# EAGLE design digit (EAGLE 4.16)
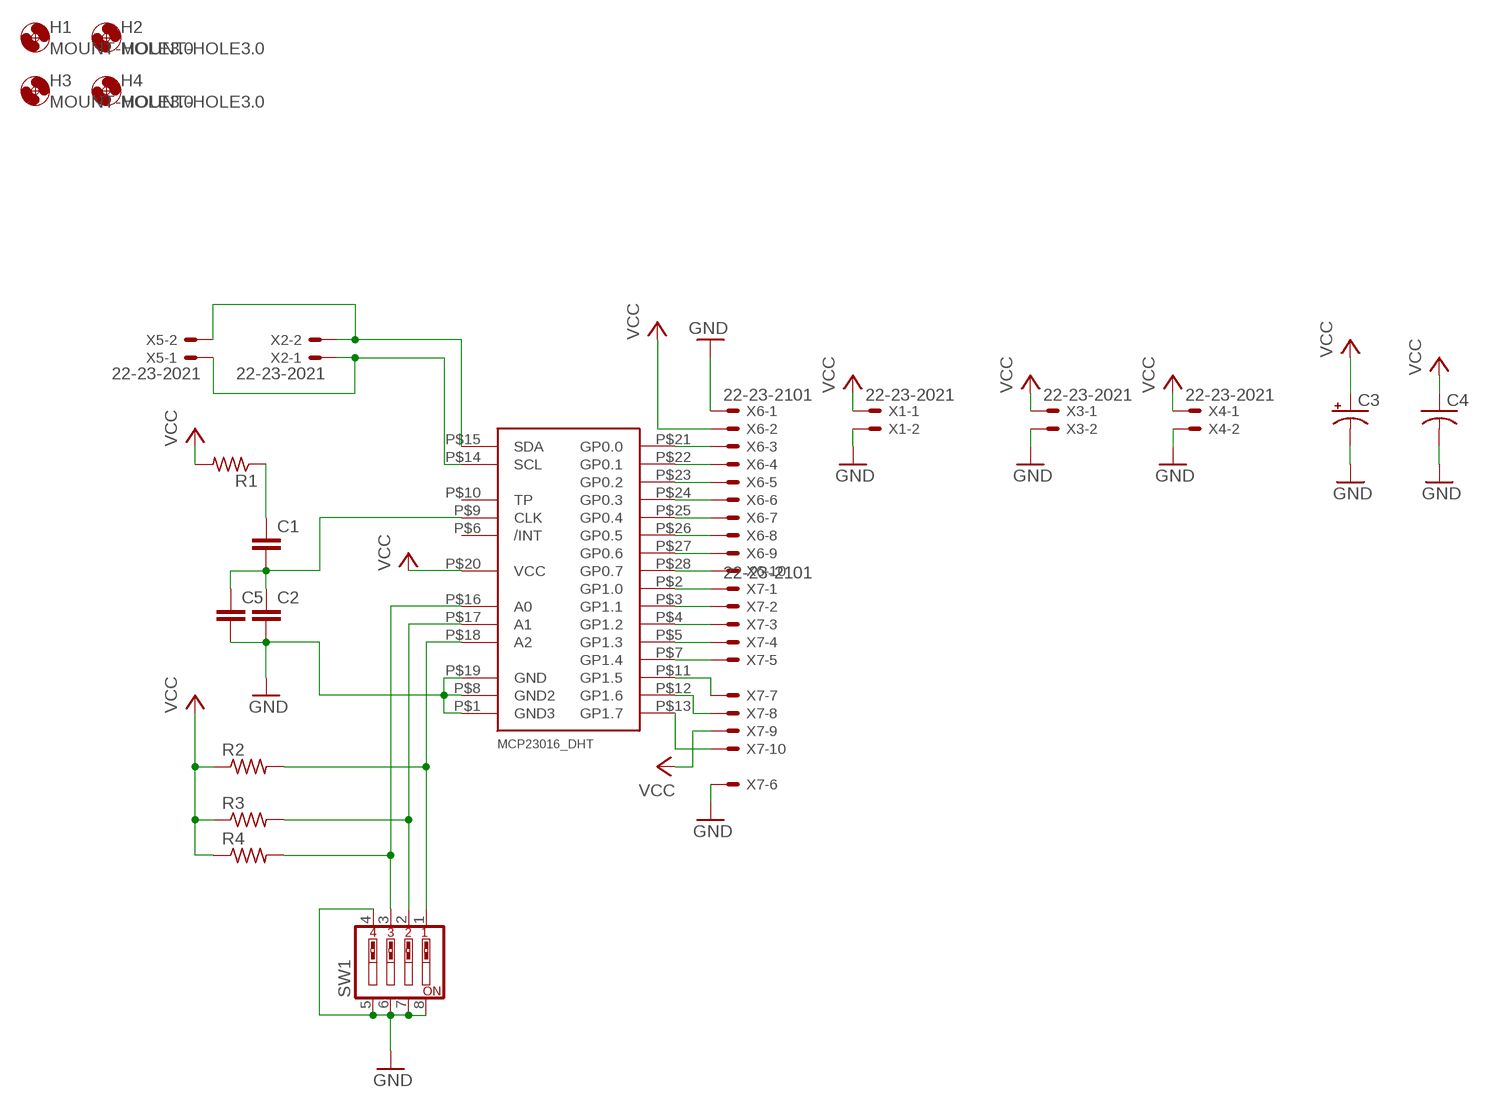
[diagram p0: schematic, sheet 1]

## Parts
C1  C2,5-3  [C2.5-3]
C2  C2,5-3  [C2.5-3]
C3  CPOL-USE5-8.5  [E5-8,5]
C4  C-US050-025X075  [C050-025X075]
C5  C2,5-3  [C2.5-3]
H1  MOUNT-HOLE3.0  [3,0]
H2  MOUNT-HOLE3.0  [3,0]
H3  MOUNT-HOLE3.0  [3,0]
H4  MOUNT-HOLE3.0  [3,0]
R1  R-US_0207/10  [0207/10]
R2  R-US_0207/10  [0207/10]
R3  R-US_0207/10  [0207/10]
R4  R-US_0207/10  [0207/10]
SW1  SW_DIP-4  [EDG-04]
U$1  MCP23016_DHT  [MCP23016_DHT]
X1  22-23-2021  [22-23-2021]
X2  22-23-2021  [22-23-2021]
X3  22-23-2021  [22-23-2021]
X4  22-23-2021  [22-23-2021]
X5  22-23-2021  [22-23-2021]
X6  22-23-2101  [22-23-2101]
X7  22-23-2101  [22-23-2101]

## Nets
GND: C2.2 C3.- C4.2 C5.2 SW1.4 SW1.5 SW1.6 SW1.7 SW1.8 U$1.P$1(GND3) U$1.P$8(GND2) U$1.P$19(GND) X1.2 X3.2 X4.2 X6.1 X7.6
N$1: U$1.P$15(SDA) X2.2 X5.2
N$2: U$1.P$21(GP0.0) X6.3
N$3: U$1.P$14(SCL) X2.1 X5.1
N$4: U$1.P$11(GP1.5) X7.7
N$5: U$1.P$22(GP0.1) X6.4
N$6: U$1.P$23(GP0.2) X6.5
N$7: U$1.P$24(GP0.3) X6.6
N$8: U$1.P$25(GP0.4) X6.7
N$9: U$1.P$26(GP0.5) X6.8
N$10: U$1.P$27(GP0.6) X6.9
N$11: U$1.P$28(GP0.7) X6.10
N$12: U$1.P$2(GP1.0) X7.1
N$13: U$1.P$3(GP1.1) X7.2
N$14: U$1.P$4(GP1.2) X7.3
N$15: U$1.P$5(GP1.3) X7.4
N$16: U$1.P$7(GP1.4) X7.5
N$17: U$1.P$12(GP1.6) X7.8
N$18: U$1.P$13(GP1.7) X7.10
N$20: C1.2 C2.1 C5.1 U$1.P$9(CLK)
N$22: R2.2 SW1.1 U$1.P$18(A2)
N$23: C1.1 R1.1
N$24: R3.2 SW1.2 U$1.P$17(A1)
N$25: R4.2 SW1.3 U$1.P$16(A0)
VCC: C3.+ C4.1 R1.2 R2.1 R3.1 R4.1 U$1.P$20(VCC) X1.1 X3.1 X4.1 X6.2 X7.9
Unconnected: U$1.P$6(/INT) U$1.P$10(TP)

## Library data of the parts
C1 C2 C5 = capacitor-wima:C: CAPACITOR naming: grid - package width
C3 = rcl:CPOL-US: POLARIZED CAPACITOR, American symbol
C4 = rcl:C-US: CAPACITOR, American symbol
H1-H4 = holes:MOUNT-HOLE: MOUNTING HOLE with drill center marker
R1-R4 = rcl:R-US_: RESISTOR, American symbol
SW1 = special:SW_DIP-4: DIP SWITCH
U$1 = aggiunte:MCP23016_DHT: MCP23016 I2C expander a 16 bit
X1-X5 = con-molex:22-23-2021: .100" (2.54mm) Center Header - 2 Pin
X6 X7 = con-molex:22-23-2101: .100" (2.54mm) Center Header - 10 Pin

## Board
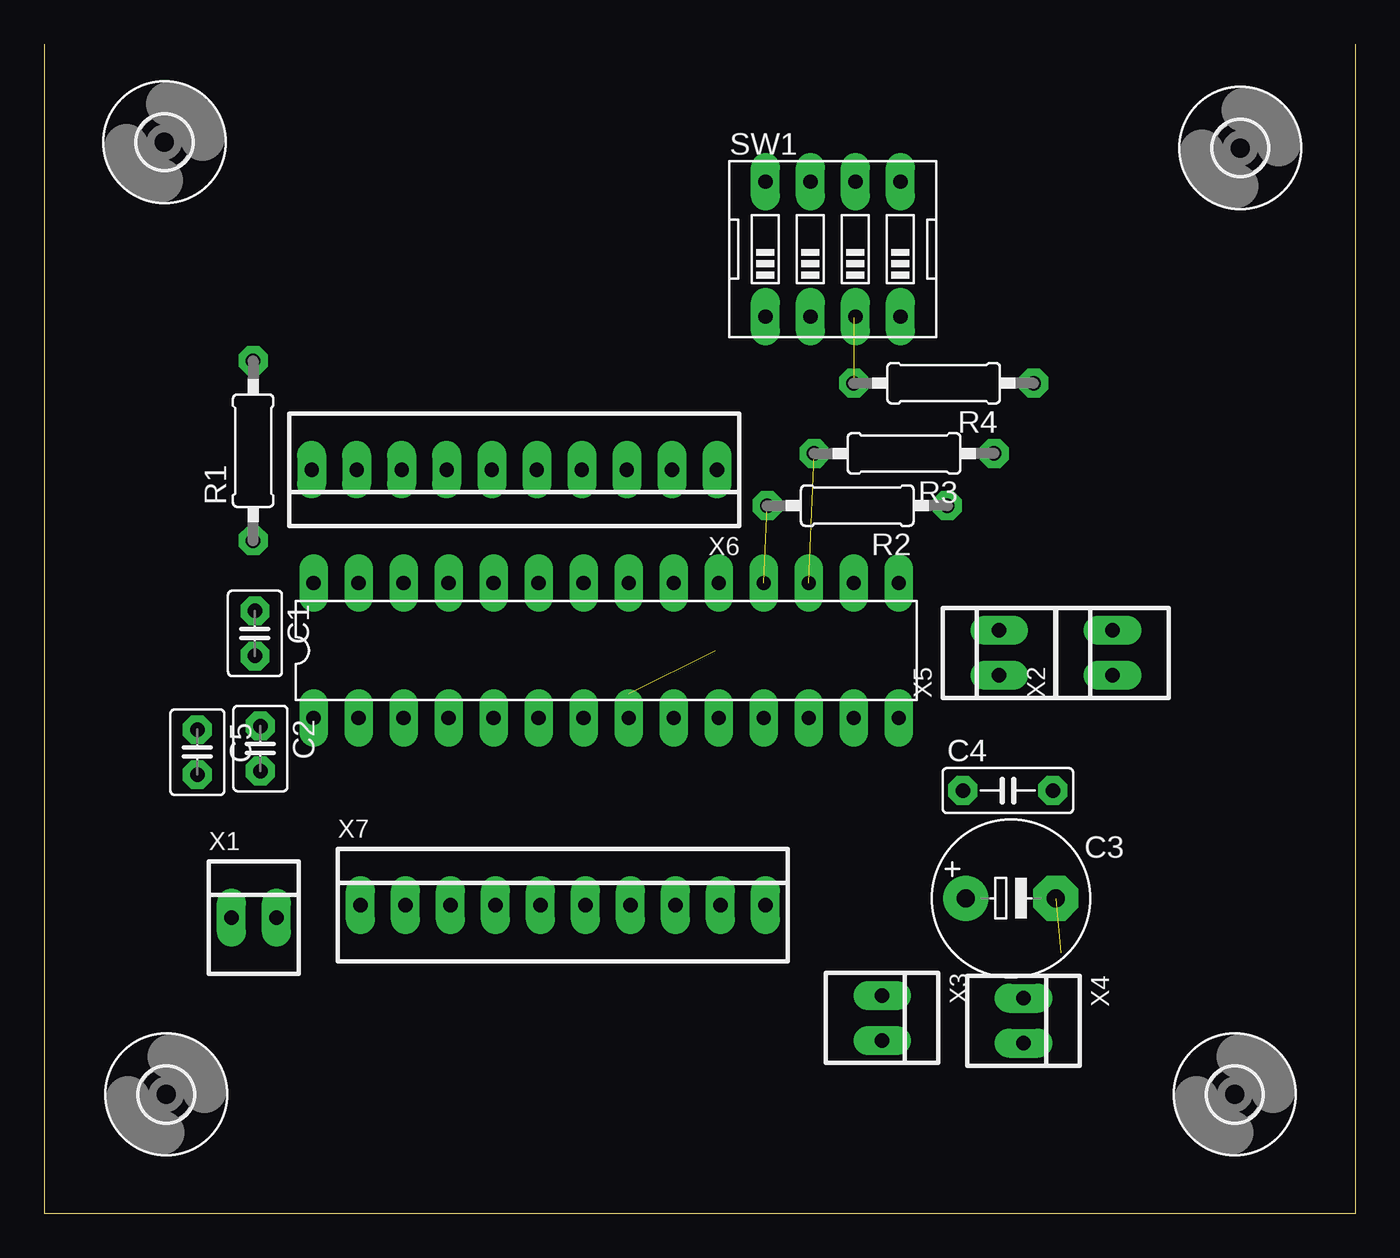
[diagram p1: board, top side]
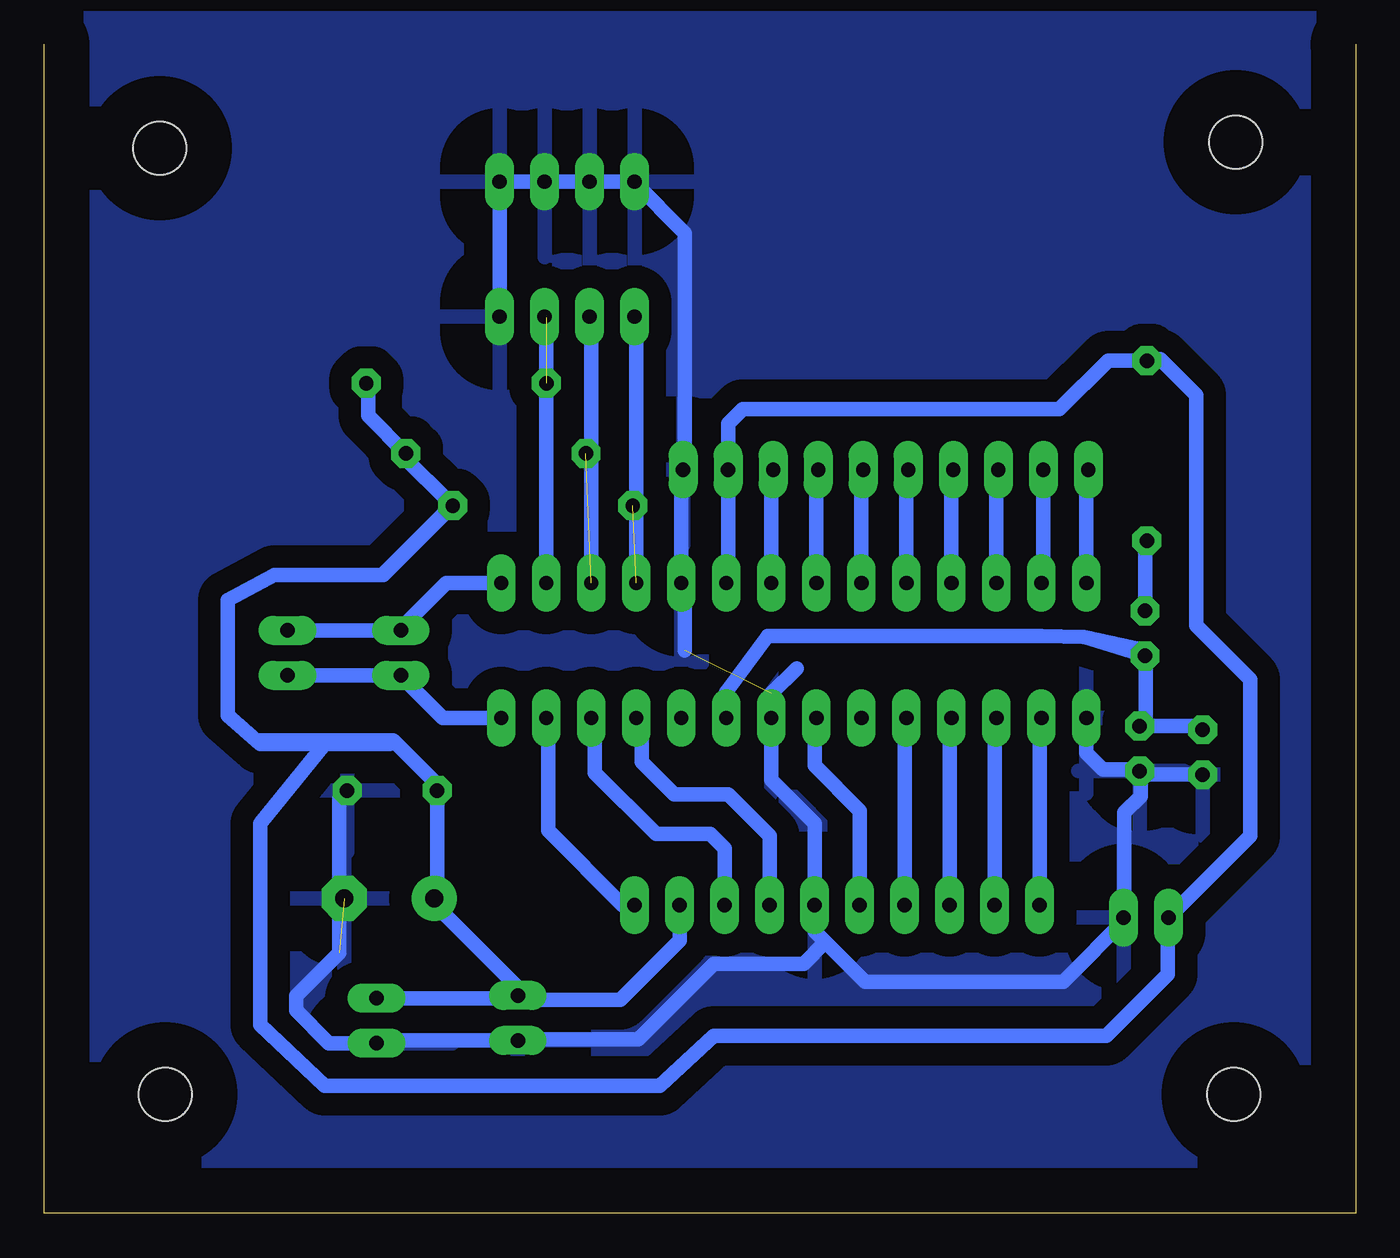
[diagram p2: board, bottom side, seen from below]

Size 74 x 66 mm. Coordinates in mm from the lower left corner, seen from the top.
Outline: 74,66 74,0 0,0 0,66
Copper layers (1*16): Top 0.035mm / dielectric 1.5mm / Bottom 0.035mm
Design rules "mio2": minimum track width 24mil, minimum drill 24mil, track to track 50mil, track to pad 50mil, pad to pad 50mil, via to via 50mil, smd to smd 50mil, copper to edge 100mil, drill to drill 100mil, minimum pad ring 16mil, minimum via ring 16mil, stop-mask expansion 4mil, vias tented up to drill 0mil, thermal gap 100mil

### Footprints (pad centres in the part's own frame; a part is rotated, then mirrored left to right if it is on the bottom)
C2.5-3 = drill 0.813 pad 1.6 octagon: 1 -1.27,0; 2 1.27,0
E5-8,5 = drill 1.016 pad 2.54 round: + -2.54,0 | drill 1.016 pad 2.54 octagon: - 2.54,0
C050-025X075 = drill 0.813 octagon: 1 -2.54,0; 2 2.54,0
3,0 = hole 3: 0,0
0207/10 = drill 0.813 octagon: 1 -5.08,0; 2 5.08,0
EDG-04 = drill 0.813 long: 1 -3.81,-3.81; 2 -1.27,-3.81; 3 1.27,-3.81; 4 3.81,-3.81; 5 3.81,3.81; 6 1.27,3.81; 7 -1.27,3.81; 8 -3.81,3.81
MCP23016_DHT = drill 0.8 long: P$1 0,0; P$2 2.54,0; P$3 5.08,0; P$4 7.62,0; P$5 10.16,0; P$6 12.7,0; P$7 15.24,0; P$8 17.78,0; P$9 20.32,0; P$10 22.86,0; P$11 25.4,0; P$12 27.94,0; P$13 30.48,0; P$14 33.02,0; P$15 33.02,7.62; P$16 30.48,7.62; P$17 27.94,7.62; P$18 25.4,7.62; P$19 22.86,7.62; P$20 20.32,7.62; P$21 17.78,7.62; P$22 15.24,7.62; P$23 12.7,7.62; P$24 10.16,7.62; P$25 7.62,7.62; P$26 5.08,7.62; P$27 2.54,7.62; P$28 0,7.62
22-23-2021 = drill 0.813 long: 1 -1.27,0; 2 1.27,0
22-23-2101 = drill 0.813 long: 1 -11.43,0; 2 -8.89,0; 3 -6.35,0; 4 -3.81,0; 5 -1.27,0; 6 1.27,0; 7 3.81,0; 8 6.35,0; 9 8.89,0; 10 11.43,0

### Placement (x,y rotation side)
C1  11.89,32.74 270 top
C2  12.19,26.24 270 top
C3  54.54,17.79 0 top
C4  54.37,23.87 0 top
C5  8.64,26.04 270 top
H1  6.88,6.72 0 top
H2  67.48,60.14 0 top
H3  6.78,60.47 0 top
H4  67.18,6.72 0 top
R1  11.79,43.06 90 top
R2  45.87,39.96 180 top
R3  48.52,42.9 180 top
R4  50.75,46.87 180 top
SW1  44.5,54.44 0 top
U$1  15.19,27.97 0 top
X1  11.82,16.7 0 top
X2  60.28,31.64 90 top
X3  47.28,11.04 270 top
X4  55.26,10.88 270 top
X5  53.88,31.64 90 top
X6  26.52,41.99 180 top
X7  29.26,17.4 0 top

### Tracks (layer width: path | path; a pad name or v marks a point on that pad's centre or on a via)
GND  (2 unrouted)
  Bottom 0.813: 12.14,24.77 C5.2 | 12.14,24.77 12.24,24.87 | U$1.P$1 15.19,25.99 14.28,25.07 12.45,25.07 12.24,24.87 | 12.24,24.87 12.19,24.92 C2.2 | 12.14,24.77 12.14,23.55 13.06,22.63 13.06,16.54 13.09,16.57 X1.2 12.89,16.7 | SW1.4 48.31,58.09 48.41,58.2 48.36,58.25 SW1.5 46.03,58.25 45.98,58.2 45.93,58.25 SW1.6 40.74,58.25 | SW1.8 40.69,58.2 40.74,58.25 | 37.85,41.89 37.85,41.53 | 37.85,41.89 X6.1 37.95,42.24 38.05,42.34 U$1.P$19 37.85,35.39 37.85,31.78 | 40.74,58.25 37.85,55.35 37.85,41.89 | 29.92,15.32 27.69,13.08 16.51,13.08 12.89,16.7 | 29.92,15.32 30.53,15.93 X7.6 30.53,22.02 32.97,24.46 U$1.P$8 32.97,29.34 31.55,30.76 | 12.89,16.7 12.85,16.74 | 29.92,15.32 31.14,14.1 36.22,14.1 40.49,9.83 46.79,9.83 46.99,9.63 47.13,9.77 X3.2 54.98,9.77 55.14,9.61 X4.2 57.95,9.61 59.79,11.46 59.79,12.27 57.36,14.71 57.36,23.45 56.93,23.87 C4.2
  pour Bottom: 0.63,0.47 0.63,67.47 72.63,67.47 72.63,1.47 0.63,1.47
N$1
  Bottom 0.813: U$1.P$15 51.31,35.59 53.9,33 53.88,32.98 X5.2 60.49,32.91 | 60.49,32.91 X2.2 | 60.49,32.91 60.61,32.8
N$2
  Bottom 0.813: 32.87,42.04 32.77,42.14 | 32.87,42.04 X6.3 | U$1.P$21 32.97,41.94 32.87,42.04
N$3
  Bottom 0.813: U$1.P$14 51.51,27.97 53.88,30.34 X5.1 60.18,30.37 60.2,30.36 60.22,30.37 X2.1
N$4
  Bottom 0.813: X7.7 33.07,21.31 35.41,23.65 38.46,23.65 40.29,25.48 40.29,27.51 40.69,27.92 40.64,27.97 U$1.P$11
N$5
  Bottom 0.813: X6.4 30.33,41.94 30.43,41.84 U$1.P$22
N$6
  Bottom 0.813: X6.5 27.79,41.84 27.69,41.74 27.89,41.53 U$1.P$23
N$7
  Bottom 0.813: X6.6 25.1,41.99 25.05,41.94 25.35,41.63 U$1.P$24
N$8
  Bottom 0.813: 22.56,41.99 22.4,42.14 | 22.56,41.99 X6.7 | U$1.P$25 22.81,41.74 22.56,41.99
N$9
  Bottom 0.813: X6.8 20.17,41.74 20.27,41.63 U$1.P$26
N$10
  Bottom 0.813: 17.63,35.54 17.68,35.59 U$1.P$27 | 17.63,35.54 X6.9 | 17.63,35.54 17.53,35.44
N$11
  Bottom 0.813: X6.10 15.09,42.14 15.19,42.04 U$1.P$28
N$12
  Bottom 0.813: 17.83,28.02 17.78,27.97 U$1.P$2 | X7.1 17.83,28.02 | 17.83,28.02 17.93,28.12
N$13
  Bottom 0.813: U$1.P$3 20.32,27.97 20.37,27.92 X7.2
N$14
  Bottom 0.813: U$1.P$4 22.81,28.12 22.91,28.02 X7.3
N$15
  Bottom 0.813: 25.35,28.02 25.25,28.12 | 25.35,28.02 U$1.P$5 | X7.4 25.45,27.92 25.35,28.02
N$16
  Bottom 0.813: X7.5 27.99,22.74 30.53,25.28 30.53,28.12 30.43,28.02 U$1.P$7
N$17
  Bottom 0.813: X7.8 35.61,20.6 36.43,21.42 39.47,21.42 42.93,24.87 42.93,27.51 43.13,27.71 U$1.P$12
N$18
  Bottom 0.813: X7.10 41.35,17.4 45.57,21.62 45.57,27.92 45.62,27.97 U$1.P$13
N$20
  Bottom 0.813: 11.84,31.47 11.84,31.58 | 11.84,31.47 C1.2 15.34,32.54 | 11.84,31.47 11.84,27.51 C2.1 8.59,27.51 8.59,27.31 C5.1 | U$1.P$9 35.51,29.44 33.17,32.59 17.73,32.59 15.34,32.54 | 15.34,32.54 11.84,31.78
N$22  (1 unrouted)
  Bottom 0.813: 40.69,50.68 40.9,50.88 | 40.69,50.68 SW1.1 | U$1.P$18 40.59,50.57 40.69,50.68
N$23
  Bottom 0.813: 11.74,37.98 11.64,38.08 | 11.74,37.98 R1.1 | C1.1 11.89,37.82 11.74,37.98
N$24  (1 unrouted)
  Bottom 0.813: SW1.2 43.23,50.57 43.33,50.47 43.13,50.27 U$1.P$17
N$25  (1 unrouted)
  Bottom 0.813: 45.62,50.63 45.57,50.68 | 45.62,50.63 SW1.3 | U$1.P$16 45.67,50.57 45.62,50.63
VCC
  Bottom 0.813: X7.9 38.15,15.42 41.51,12.07 46.79,12.07 47.2,12.48 47.28,12.39 X3.1 | 55.73,46.97 55.73,47.02 | 55.73,46.97 R4.1 | 55.73,46.97 55.73,45.04 R3.1 53.65,42.95 53.9,42.95 53.9,42.9 R2.1 | U$1.P$20 35.41,35.69 X6.2 35.41,44.58 34.6,45.39 16.71,45.39 13.97,48.14 R1.2 11.74,48.14 11.64,48.24 11.02,48.24 8.99,46.21 8.99,33.2 5.95,30.15 5.95,21.31 X1.1 10.59,16.74 10.62,16.74 10.62,13.49 14.07,10.04 36.22,10.04 39.27,7.19 58.17,7.19 61.83,10.65 61.83,22.02 58.17,26.5 | 50.9,39.91 R2.1 | 50.9,39.91 50.85,39.91 | R2.1 54.87,36.05 54.92,36.05 | 63.65,28.12 62.03,26.7 | X3.1 47.16,12.31 46.99,12.48 52.01,17.49 C3.+ 51.9,17.79 51.87,17.76 51.83,17.79 C4.1 51.83,24.23 54.31,26.7 62.03,26.7 | 61.83,26.5 63.65,28.12 | X3.1 47.28,12.36 47.4,12.48 47.72,12.15 X4.1 | 50.9,39.91 51.06,39.91 54.92,36.05 | 54.92,36.05 61.01,36.05 63.65,34.62 63.65,28.12 | 61.83,26.5 62.03,26.7 | 58.17,26.5 61.83,26.5 | 58.17,26.5 54.51,26.5